# Altium schematic sheet example connect.SchDoc
size A4; SheetNumber: 1; SheetTotal: 8
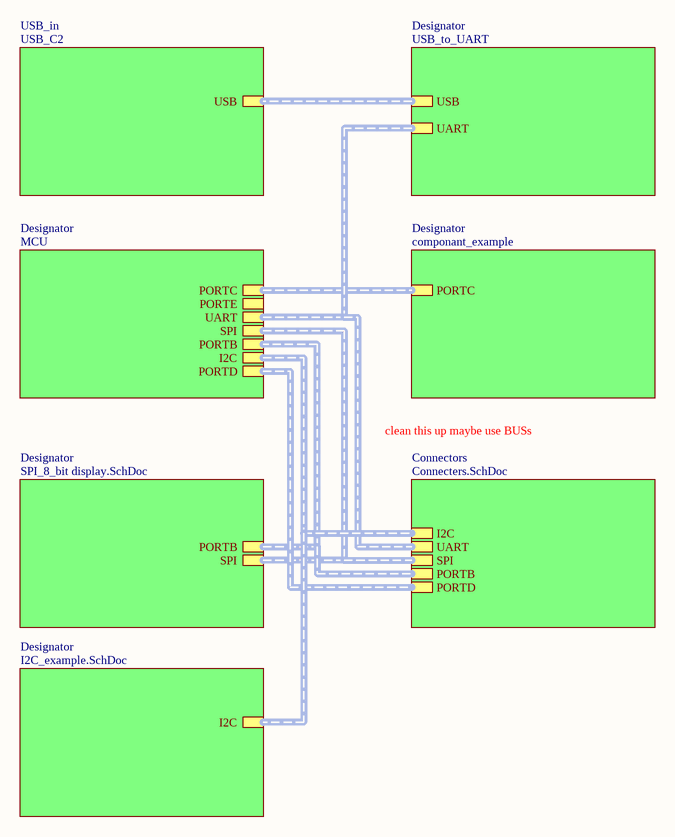
[diagram p0: example connect.SchDoc]

## Sub-sheets
Connectors = Connecters.SchDoc: I2C (harness I2C), UART (harness UART), SPI (harness SPI), PORTB (harness PORTB), PORTD (harness PORTD)
Designator = MCU: PORTC (harness PORTC), PORTE (harness PORTE), UART (harness UART), SPI (harness SPI), PORTB (harness PORTB), I2C (harness I2C), PORTD (harness PORTD)
Designator = componant_example: PORTC (harness PORTC)
Designator = USB_to_UART: USB (harness USB), UART (harness UART)
Designator = SPI_8_bit display.SchDoc: SPI (harness SPI), PORTB (harness PORTB)
Designator = I2C_example.SchDoc: I2C (harness I2C)
USB_in = USB_C2: USB (harness USB)

## Buses and harness runs
harness sheet Connectors/I2C = sheet Designator/I2C
harness sheet Connectors/PORTB = sheet Designator/PORTB
harness sheet Connectors/PORTD = sheet Designator/PORTD
harness sheet Connectors/SPI = sheet Designator/SPI
harness sheet Connectors/UART = sheet Designator/UART
harness sheet Designator/USB = sheet USB_in/USB

## Notes on the sheet
- clean this up maybe use BUSs